# EAGLE schematic PIR (EAGLE 9.1.1)
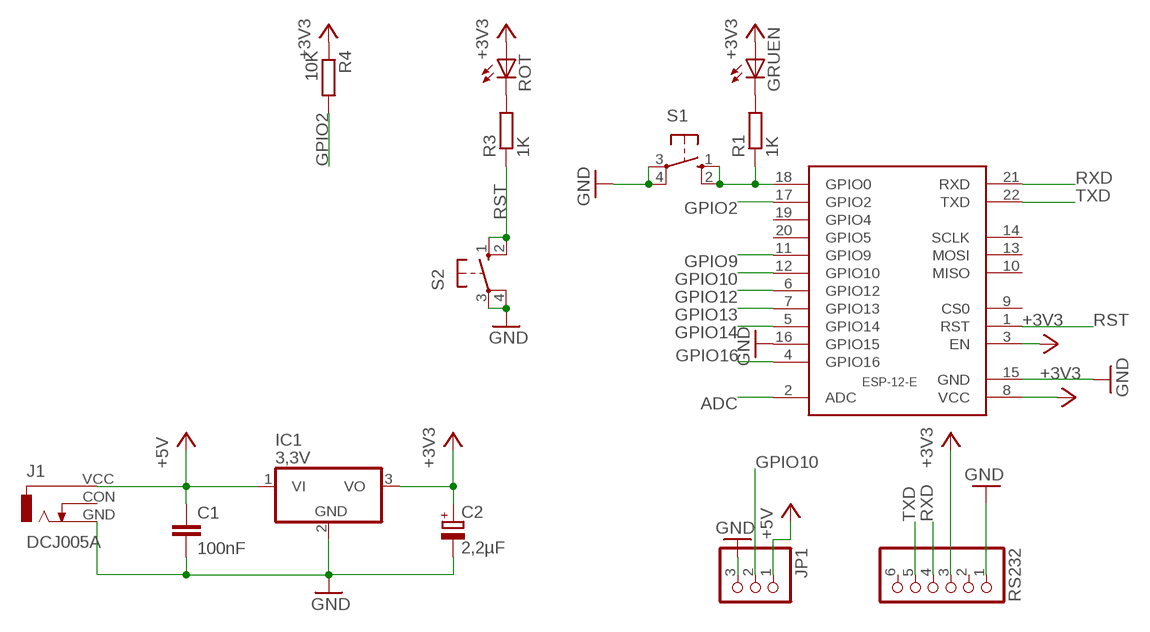
[diagram p0: schematic, sheet 1]

## Parts
C1  100nF  C-EU050-030X075  [C050-030X075]
C2  2,2µF  CPOL-EUE2.5-6  [E2,5-6]
GRUEN  LED5MM  [LED5MM]
IC1  3,3V  7805TV  [TO220V]
J1  DCJ005A  [DC005A]
JP1  PINHD-1X3  [1X03]
R1  1K  R-EU_0207/10  [0207/10]
R3  1K  R-EU_0207/10  [0207/10]
R4  10K  R-EU_0207/10  [0207/10]
ROT  LED5MM  [LED5MM]
RS232  PINHD-1X6  [1X06]
S1  10-XX  [B3F-10XX]
S2  10-XX  [B3F-10XX]
U$1  ESP-12-E  [ESP-12-E]

## Nets
+3V3: C2.+ GRUEN.A IC1.3(VO) R4.1 ROT.A RS232.3 U$1.3(EN) U$1.8(VCC)
+5V: C1.1 IC1.1(VI) J1.VCC JP1.1
ADC: U$1.2(ADC)
GND: C1.2 C2.- IC1.2(GND) J1.GND JP1.3 RS232.1 S1.3(P) S1.4(P1) S2.3(P) S2.4(P1) U$1.15(GND) U$1.16(GPIO15)
GPIO2: R4.2 U$1.17(GPIO2)
GPIO9: U$1.11(GPIO9)
GPIO10: JP1.2 U$1.12(GPIO10)
GPIO12: U$1.6(GPIO12)
GPIO13: U$1.7(GPIO13)
GPIO14: U$1.5(GPIO14)
GPIO16: U$1.4(GPIO16)
N$1: R1.1 S1.1(S) S1.2(S1) U$1.18(GPIO0)
N$3: GRUEN.K(C) R1.2
N$4: R3.2 ROT.K(C)
RST: R3.1 S2.1(S) S2.2(S1) U$1.1(RST)
RXD: RS232.4 U$1.21(RXD)
TXD: RS232.5 U$1.22(TXD)
Unconnected: J1.CON RS232.2 RS232.6 U$1.9(CS0) U$1.10(MISO) U$1.13(MOSI) U$1.14(SCLK) U$1.19(GPIO4) U$1.20(GPIO5)

## Library data of the parts
C1 = rcl:C-EU: CAPACITOR, European symbol
C2 = rcl:CPOL-EU: POLARIZED CAPACITOR, European symbol
GRUEN ROT = !Häufige Bauteile:LED5MM
IC1 = linear:78*: Positive VOLTAGE REGULATOR Source: http://cache.national.com/ds/LM/LM78L05.pdf http://www.fairchildsemi.com/ds/LM/LM7805.pdf
J1 = !Häufige Bauteile:DCJ005A: DC POWER JACK Source: DCJ0202.pdf; OC_FARNELL: unknown; OC_NEWARK: unknown
JP1 = pinhead:PINHD-1X3: PIN HEADER
R1 R3 R4 = rcl:R-EU_: RESISTOR, European symbol
RS232 = pinhead:PINHD-1X6: PIN HEADER
S1 S2 = switch-omron:10-XX: OMRON SWITCH; MPN: B3F-1000; OC_FARNELL: 176432; OC_NEWARK: 36M3542
U$1 = !Eigene Library SMD:ESP-12-E